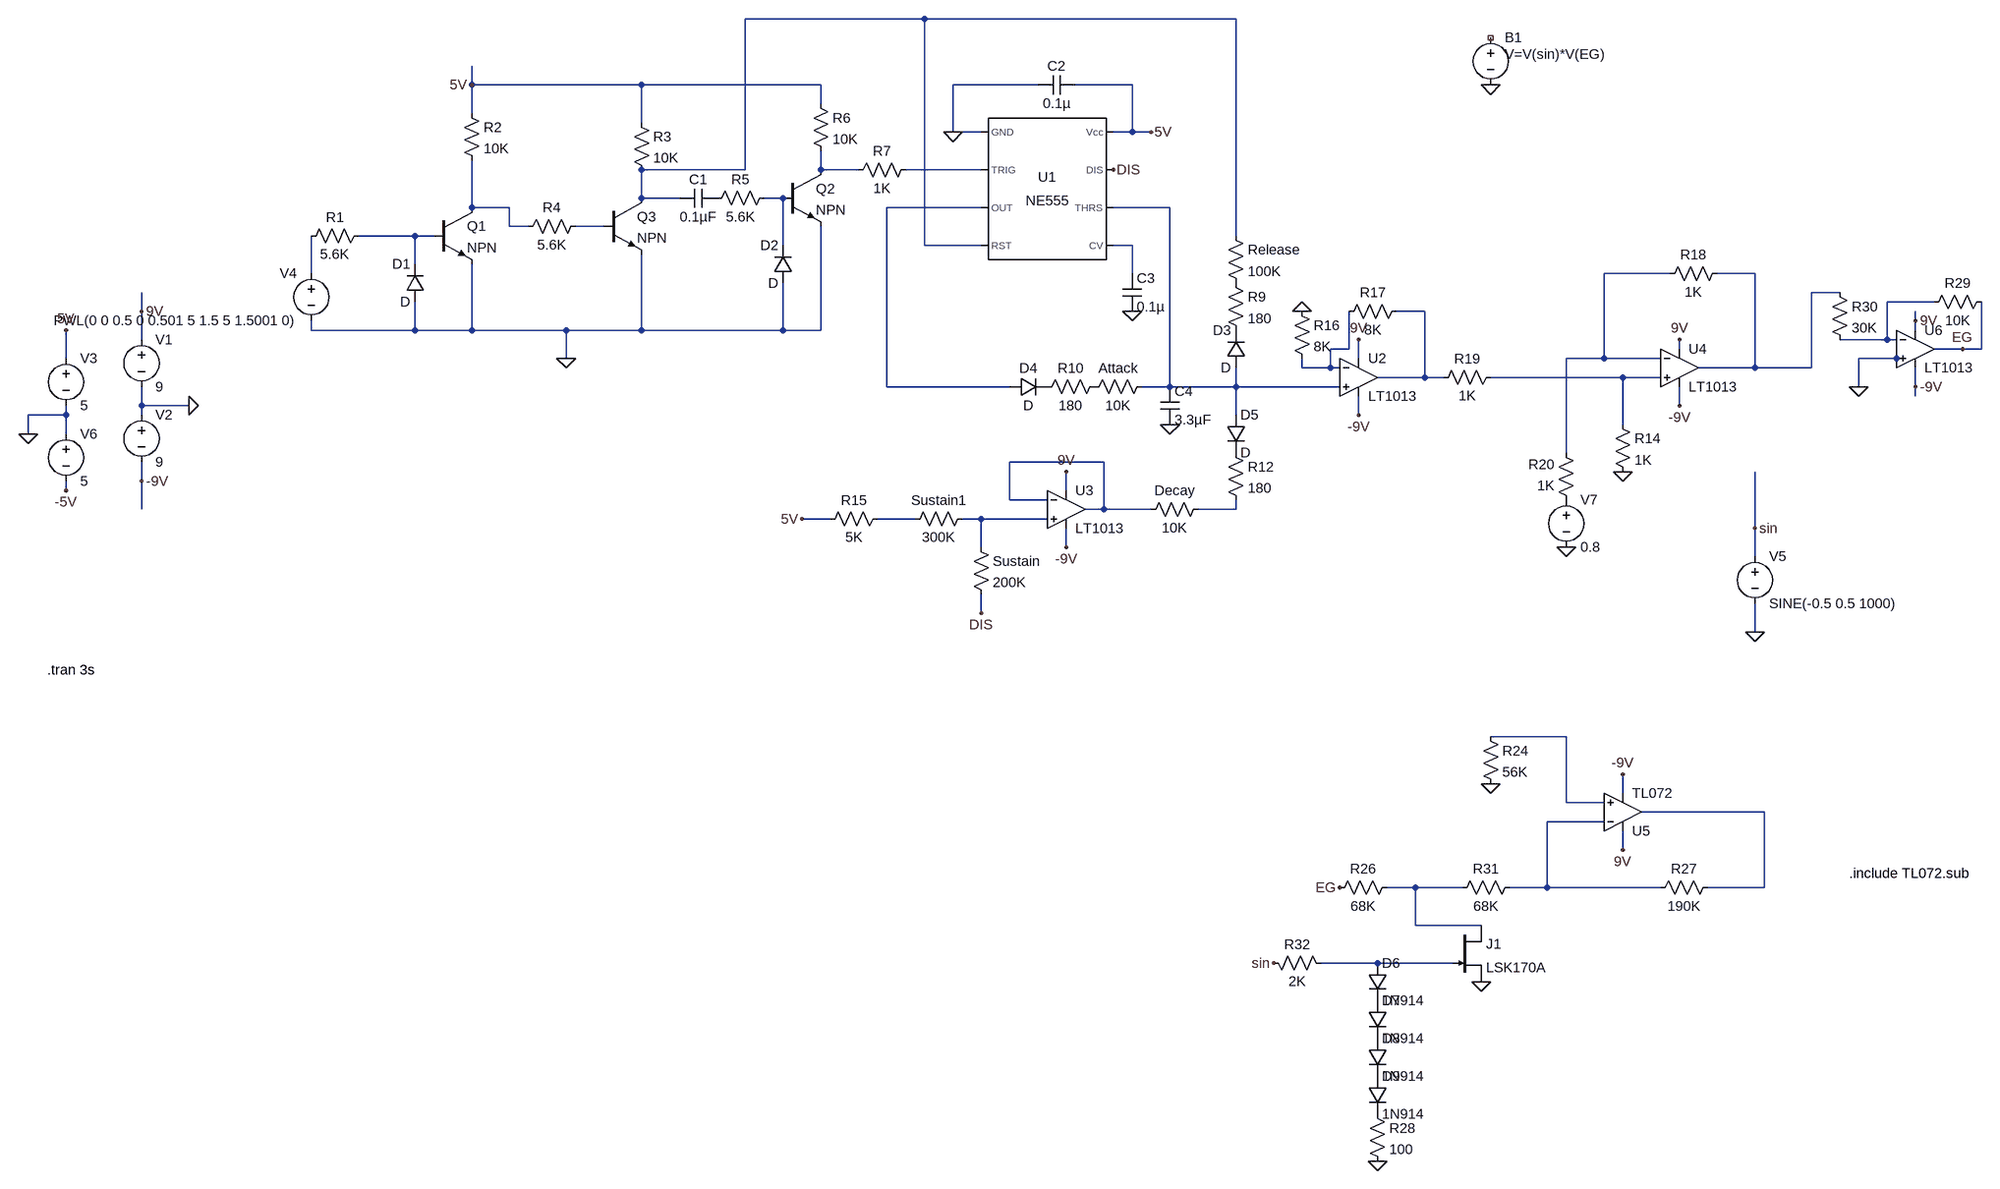
[diagram p0: schematic EG.asc]
EG.asc, the LTspice schematic file:
Version 4
SHEET 1 4756 1892
WIRE 272 -272 -32 -272
WIRE 800 -272 272 -272
WIRE -496 -160 -496 -192
WIRE -208 -160 -496 -160
WIRE 96 -160 -208 -160
WIRE 464 -160 320 -160
WIRE 624 -160 528 -160
WIRE 96 -128 96 -160
WIRE -496 -112 -496 -160
WIRE -208 -96 -208 -160
WIRE 320 -80 320 -160
WIRE 368 -80 320 -80
WIRE 624 -80 624 -160
WIRE 624 -80 592 -80
WIRE 656 -80 624 -80
WIRE -32 -16 -32 -272
WIRE -32 -16 -208 -16
WIRE 96 -16 96 -48
WIRE 160 -16 96 -16
WIRE 368 -16 240 -16
WIRE -208 32 -208 -16
WIRE -144 32 -208 32
WIRE 32 32 0 32
WIRE -496 48 -496 -32
WIRE -432 48 -496 48
WIRE 368 48 208 48
WIRE 688 48 592 48
WIRE -432 80 -432 48
WIRE -400 80 -432 80
WIRE -272 80 -320 80
WIRE -592 96 -688 96
WIRE -560 96 -592 96
WIRE 800 96 800 -272
WIRE 32 112 32 32
WIRE 272 112 272 -272
WIRE 368 112 272 112
WIRE 624 112 592 112
WIRE -592 144 -592 96
WIRE -768 160 -768 96
WIRE 624 160 624 112
WIRE 1536 160 1424 160
WIRE 1680 160 1616 160
WIRE 1824 192 1776 192
WIRE 1984 208 1904 208
WIRE -1056 224 -1056 192
WIRE 1120 224 1072 224
WIRE 1952 240 1952 224
WIRE -768 256 -768 240
WIRE -592 256 -592 208
WIRE -592 256 -768 256
WIRE -496 256 -496 144
WIRE -496 256 -592 256
WIRE -336 256 -496 256
WIRE -208 256 -208 128
WIRE -208 256 -336 256
WIRE 32 256 32 176
WIRE 32 256 -208 256
WIRE 96 256 96 80
WIRE 96 256 32 256
WIRE 1952 256 1952 240
WIRE -1056 272 -1056 224
WIRE 1904 272 1904 208
WIRE 1904 272 1824 272
WIRE 1920 272 1904 272
WIRE 992 288 992 224
WIRE 992 288 960 288
WIRE 1552 288 1552 272
WIRE 2032 288 1984 288
WIRE 2064 288 2064 208
WIRE 2064 288 2032 288
WIRE -1184 304 -1184 256
WIRE -336 304 -336 256
WIRE 1008 304 1008 272
WIRE 1424 304 1424 160
WIRE 1424 304 1360 304
WIRE 1520 304 1424 304
WIRE 1920 304 1856 304
WIRE 912 320 912 304
WIRE 960 320 960 288
WIRE 960 320 912 320
WIRE 976 320 960 320
WIRE 1680 320 1680 160
WIRE 1680 320 1584 320
WIRE 1776 320 1776 192
WIRE 1776 320 1680 320
WIRE 1920 320 1920 304
WIRE 1120 336 1120 224
WIRE 1120 336 1040 336
WIRE 1152 336 1120 336
WIRE 1456 336 1232 336
WIRE 1520 336 1456 336
WIRE 208 352 208 48
WIRE 416 352 208 352
WIRE 688 352 688 48
WIRE 688 352 640 352
WIRE 800 352 800 320
WIRE 800 352 688 352
WIRE 976 352 800 352
WIRE 1856 352 1856 304
WIRE 1952 352 1952 320
WIRE 1952 368 1952 352
WIRE -1056 384 -1056 352
WIRE -976 384 -1056 384
WIRE 1552 384 1552 352
WIRE -1184 400 -1184 384
WIRE -1184 400 -1248 400
WIRE -1056 400 -1056 384
WIRE 800 400 800 352
WIRE 1008 400 1008 368
WIRE 1456 416 1456 336
WIRE -1248 432 -1248 400
WIRE -1184 432 -1184 400
WIRE 1360 464 1360 304
WIRE 576 480 416 480
WIRE -1056 512 -1056 480
WIRE -1184 528 -1184 512
WIRE 512 528 512 496
WIRE 416 544 416 480
WIRE 480 544 416 544
WIRE -1056 560 -1056 512
WIRE 576 560 576 480
WIRE 576 560 544 560
WIRE 656 560 576 560
WIRE 800 560 800 544
WIRE 800 560 736 560
WIRE 112 576 64 576
WIRE 256 576 192 576
WIRE 368 576 336 576
WIRE 480 576 368 576
WIRE 1680 592 1680 496
WIRE 368 624 368 576
WIRE 512 624 512 592
WIRE 1680 640 1680 592
WIRE 368 736 368 704
WIRE 1680 768 1680 720
WIRE 1360 1152 1232 1152
WIRE 1456 1248 1456 1216
WIRE 1360 1264 1360 1152
WIRE 1424 1264 1360 1264
WIRE 1696 1280 1488 1280
WIRE 1424 1296 1328 1296
WIRE 1456 1344 1456 1312
WIRE 1104 1408 1056 1408
WIRE 1184 1408 1104 1408
WIRE 1328 1408 1328 1296
WIRE 1328 1408 1264 1408
WIRE 1520 1408 1328 1408
WIRE 1696 1408 1696 1280
WIRE 1696 1408 1600 1408
WIRE 1104 1472 1104 1408
WIRE 1216 1472 1104 1472
WIRE 1040 1536 944 1536
WIRE 1168 1536 1040 1536
FLAG -336 304 0
FLAG -976 384 0
FLAG -1056 224 9V
FLAG -1056 512 -9V
FLAG -1184 256 5V
FLAG -496 -160 5V
FLAG 320 -80 0
FLAG 624 224 0
FLAG 688 416 0
FLAG 912 224 0
FLAG 512 496 9V
FLAG 512 624 -9V
FLAG 1008 272 9V
FLAG 1008 400 -9V
FLAG 368 736 DIS
FLAG 592 -16 DIS
FLAG -1248 432 0
FLAG -1184 528 -5V
FLAG 1232 -160 0
FLAG 1680 592 sin
FLAG 1456 496 0
FLAG 1360 624 0
FLAG 1552 272 9V
FLAG 1552 384 -9V
FLAG 64 576 5V
FLAG 656 -80 5V
FLAG 1680 768 0
FLAG 1952 240 9V
FLAG 1952 352 -9V
FLAG 1856 352 0
FLAG 1232 1232 0
FLAG 1456 1216 -9V
FLAG 1456 1344 9V
FLAG 1216 1568 0
FLAG 1040 1872 0
FLAG 2032 288 EG
FLAG 976 1408 EG
FLAG 864 1536 sin
SYMBOL Misc\\NE555 480 16 R0
SYMATTR InstName U1
SYMBOL res -672 80 R90
WINDOW 0 0 56 VBottom 2
WINDOW 3 32 56 VTop 2
SYMATTR InstName R1
SYMATTR Value 5.6K
SYMBOL npn -560 48 R0
SYMATTR InstName Q1
SYMBOL npn 32 -16 R0
SYMATTR InstName Q2
SYMBOL npn -272 32 R0
SYMATTR InstName Q3
SYMBOL res -512 -128 R0
SYMATTR InstName R2
SYMATTR Value 10K
SYMBOL diode -576 208 R180
WINDOW 0 24 64 Left 2
WINDOW 3 24 0 Left 2
SYMATTR InstName D1
SYMBOL voltage -1056 256 R0
WINDOW 123 0 0 Left 0
WINDOW 39 0 0 Left 0
SYMATTR InstName V1
SYMATTR Value 9
SYMBOL voltage -1056 384 R0
WINDOW 123 0 0 Left 0
WINDOW 39 0 0 Left 0
SYMATTR InstName V2
SYMATTR Value 9
SYMBOL voltage -1184 288 R0
WINDOW 123 0 0 Left 0
WINDOW 39 0 0 Left 0
SYMATTR InstName V3
SYMATTR Value 5
SYMBOL res -224 -112 R0
SYMATTR InstName R3
SYMATTR Value 10K
SYMBOL res -304 64 R90
WINDOW 0 0 56 VBottom 2
WINDOW 3 32 56 VTop 2
SYMATTR InstName R4
SYMATTR Value 5.6K
SYMBOL cap -80 16 R90
WINDOW 0 0 32 VBottom 2
WINDOW 3 32 32 VTop 2
SYMATTR InstName C1
SYMATTR Value 0.1µF
SYMBOL res 16 16 R90
WINDOW 0 0 56 VBottom 2
WINDOW 3 32 56 VTop 2
SYMATTR InstName R5
SYMATTR Value 5.6K
SYMBOL diode 48 176 R180
WINDOW 0 24 64 Left 2
WINDOW 3 24 0 Left 2
SYMATTR InstName D2
SYMBOL res 80 -144 R0
SYMATTR InstName R6
SYMATTR Value 10K
SYMBOL res 256 -32 R90
WINDOW 0 0 56 VBottom 2
WINDOW 3 32 56 VTop 2
SYMATTR InstName R7
SYMATTR Value 1K
SYMBOL cap 528 -176 R90
WINDOW 0 0 32 VBottom 2
WINDOW 3 32 32 VTop 2
SYMATTR InstName C2
SYMATTR Value 0.1µ
SYMBOL cap 608 160 R0
SYMATTR InstName C3
SYMATTR Value 0.1µ
SYMBOL res 784 80 R0
SYMATTR InstName Release
SYMATTR Value 100K
SYMBOL res 784 160 R0
SYMATTR InstName R9
SYMATTR Value 180
SYMBOL diode 816 320 R180
WINDOW 0 24 64 Left 2
WINDOW 3 24 0 Left 2
SYMATTR InstName D3
SYMBOL diode 416 368 R270
WINDOW 0 32 32 VTop 2
WINDOW 3 0 32 VBottom 2
SYMATTR InstName D4
SYMBOL res 576 336 R90
WINDOW 0 0 56 VBottom 2
WINDOW 3 32 56 VTop 2
SYMATTR InstName R10
SYMATTR Value 180
SYMBOL res 656 336 R90
WINDOW 0 0 56 VBottom 2
WINDOW 3 32 56 VTop 2
SYMATTR InstName Attack
SYMATTR Value 10K
SYMBOL cap 672 352 R0
SYMATTR InstName C4
SYMATTR Value 3.3µF
SYMBOL diode 784 400 R0
SYMATTR InstName D5
SYMBOL res 784 448 R0
SYMATTR InstName R12
SYMATTR Value 180
SYMBOL res 752 544 R90
WINDOW 0 0 56 VBottom 2
WINDOW 3 32 56 VTop 2
SYMATTR InstName Decay
SYMATTR Value 10K
SYMBOL res 352 560 R90
WINDOW 0 0 56 VBottom 2
WINDOW 3 32 56 VTop 2
SYMATTR InstName Sustain1
SYMATTR Value 300K
SYMBOL res 208 560 R90
WINDOW 0 0 56 VBottom 2
WINDOW 3 32 56 VTop 2
SYMATTR InstName R15
SYMATTR Value 5K
SYMBOL res 896 208 R0
SYMATTR InstName R16
SYMATTR Value 8K
SYMBOL res 1088 208 R90
WINDOW 0 0 56 VBottom 2
WINDOW 3 32 56 VTop 2
SYMATTR InstName R17
SYMATTR Value 8K
SYMBOL res 352 608 R0
SYMATTR InstName Sustain
SYMATTR Value 200K
SYMBOL voltage -768 144 M0
WINDOW 123 0 0 Left 0
WINDOW 39 0 0 Left 0
SYMATTR InstName V4
SYMATTR Value PWL(0 0 0.5 0 0.501 5 1.5 5 1.5001 0)
SYMBOL Opamps\\LT1013 1008 272 R0
SYMATTR InstName U2
SYMBOL Opamps\\LT1013 512 496 R0
SYMATTR InstName U3
SYMBOL voltage 1680 624 R0
WINDOW 123 0 0 Left 0
WINDOW 39 0 0 Left 0
SYMATTR InstName V5
SYMATTR Value SINE(-0.5 0.5 1000)
SYMBOL voltage -1184 416 R0
WINDOW 123 0 0 Left 0
WINDOW 39 0 0 Left 0
SYMATTR InstName V6
SYMATTR Value 5
SYMBOL voltage 1232 -256 R0
WINDOW 3 24 44 Left 2
SYMATTR Value V=V(sin)*V(EG)
SYMATTR InstName B1
SYMATTR Prefix B
SYMBOL res 1440 400 R0
SYMATTR InstName R14
SYMATTR Value 1K
SYMBOL res 1632 144 R90
WINDOW 0 0 56 VBottom 2
WINDOW 3 32 56 VTop 2
SYMATTR InstName R18
SYMATTR Value 1K
SYMBOL res 1248 320 R90
WINDOW 0 0 56 VBottom 2
WINDOW 3 32 56 VTop 2
SYMATTR InstName R19
SYMATTR Value 1K
SYMBOL res 1376 560 R180
WINDOW 0 36 76 Left 2
WINDOW 3 36 40 Left 2
SYMATTR InstName R20
SYMATTR Value 1K
SYMBOL Opamps\\LT1013 1552 256 R0
SYMATTR InstName U4
SYMBOL voltage 1360 528 R0
WINDOW 123 0 0 Left 0
WINDOW 39 0 0 Left 0
SYMATTR InstName V7
SYMATTR Value 0.8
SYMBOL Opamps\\LT1013 1952 224 R0
SYMATTR InstName U6
SYMBOL res 2080 192 R90
WINDOW 0 0 56 VBottom 2
WINDOW 3 32 56 VTop 2
SYMATTR InstName R29
SYMATTR Value 10K
SYMBOL res 1808 176 R0
SYMATTR InstName R30
SYMATTR Value 30K
SYMBOL res 1216 1136 R0
SYMATTR InstName R24
SYMATTR Value 56K
SYMBOL res 1616 1392 R90
WINDOW 0 0 56 VBottom 2
WINDOW 3 32 56 VTop 2
SYMATTR InstName R27
SYMATTR Value 190K
SYMBOL res 1072 1392 R90
WINDOW 0 0 56 VBottom 2
WINDOW 3 32 56 VTop 2
SYMATTR InstName R26
SYMATTR Value 68K
SYMBOL res 1280 1392 R90
WINDOW 0 0 56 VBottom 2
WINDOW 3 32 56 VTop 2
SYMATTR InstName R31
SYMATTR Value 68K
SYMBOL res 848 1520 M90
WINDOW 0 0 56 VBottom 2
WINDOW 3 32 56 VTop 2
SYMATTR InstName R32
SYMATTR Value 2K
SYMBOL diode 1024 1536 R0
SYMATTR InstName D6
SYMATTR Value 1N914
SYMBOL diode 1024 1600 R0
SYMATTR InstName D7
SYMATTR Value 1N914
SYMBOL diode 1024 1664 R0
SYMATTR InstName D8
SYMATTR Value 1N914
SYMBOL diode 1024 1728 R0
SYMATTR InstName D9
SYMATTR Value 1N914
SYMBOL res 1024 1776 R0
SYMATTR InstName R28
SYMATTR Value 100
SYMBOL njf 1168 1472 R0
SYMATTR InstName J1
SYMATTR Value LSK170A
SYMBOL Opamps\\opamp2 1456 1344 M180
SYMATTR InstName U5
SYMATTR Value TL072
TEXT -1216 832 Left 2 !.tran 3s
TEXT 1840 1384 Left 2 !.include TL072.sub

The netlist it stands for:
* EG.asc
XU1 0 N003 N006 N001 N010 N007 DIS 5V NE555  ; pins GND TRIG OUT RST CV THRS DIS Vcc
R1 N009 N011 5.6K
Q1 N005 N009 0 0 NPN
Q2 N002 N004 0 0 NPN
Q3 N001 N008 0 0 NPN
R2 5V N005 10K
D1 0 N009 D
V1 9V 0 9
V2 0 -9V 9
V3 5V 0 5
R3 5V N001 10K
R4 N008 N005 5.6K
C1 P001 N001 0.1µF
R5 N004 P001 5.6K
D2 0 N004 D
R6 5V N002 10K
R7 N003 N002 1K
C2 5V 0 0.1µ
C3 N010 0 0.1µ
Release N001 P002 100K
R9 P002 P003 180
D3 N007 P003 D
D4 N006 P004 D
R10 P005 P004 180
R§Attack N007 P005 10K
C4 N007 0 3.3µF
D5 N007 P006 D
R12 P006 N019 180
R§Decay N019 N018 10K
R§Sustain1 N021 N020 300K
R15 N020 5V 5K
R16 0 N016 8K
R17 N015 N016 8K
R§Sustain N021 DIS 200K
V4 N011 0 PWL(0 0 0.5 0 0.501 5 1.5 5 1.5001 0)
XU2 N007 N016 9V -9V N015 LT1013  ; pins In+ In- V+ V- OUT
XU3 N021 N018 9V -9V N018 LT1013  ; pins In+ In- V+ V- OUT
V5 sin 0 SINE(-0.5 0.5 1000)
V6 0 -5V 5
B1 NC_01 0 V=V(sin)*V(EG)
R14 N017 0 1K
R18 N013 N012 1K
R19 N017 N015 1K
R20 P007 N012 1K
XU4 N017 N012 9V -9V N013 LT1013  ; pins In+ In- V+ V- OUT
V7 P007 0 0.8
XU6 0 N014 9V -9V EG LT1013  ; pins In+ In- V+ V- OUT
R29 EG N014 10K
R30 N013 N014 30K
R24 N022 0 56K
R27 N023 N024 190K
R26 N025 EG 68K
R31 N024 N025 68K
R32 sin N026 2K
D6 N026 P008 1N914
D7 P008 P009 1N914
D8 P009 P010 1N914
D9 P010 P011 1N914
R28 P011 0 100
J1 N025 N026 0 LSK170A
XU5 N022 N024 9V -9V N023 TL072  ; pins In+ In- V+ V- OUT
.model D D
.lib standard.dio
.model NPN NPN
.model PNP PNP
.lib standard.bjt
.model NJF NJF
.model PJF PJF
.lib standard.jft
.tran 3s
.include TL072.sub
.lib NE555.sub
.lib LTC.lib
.backanno
.end